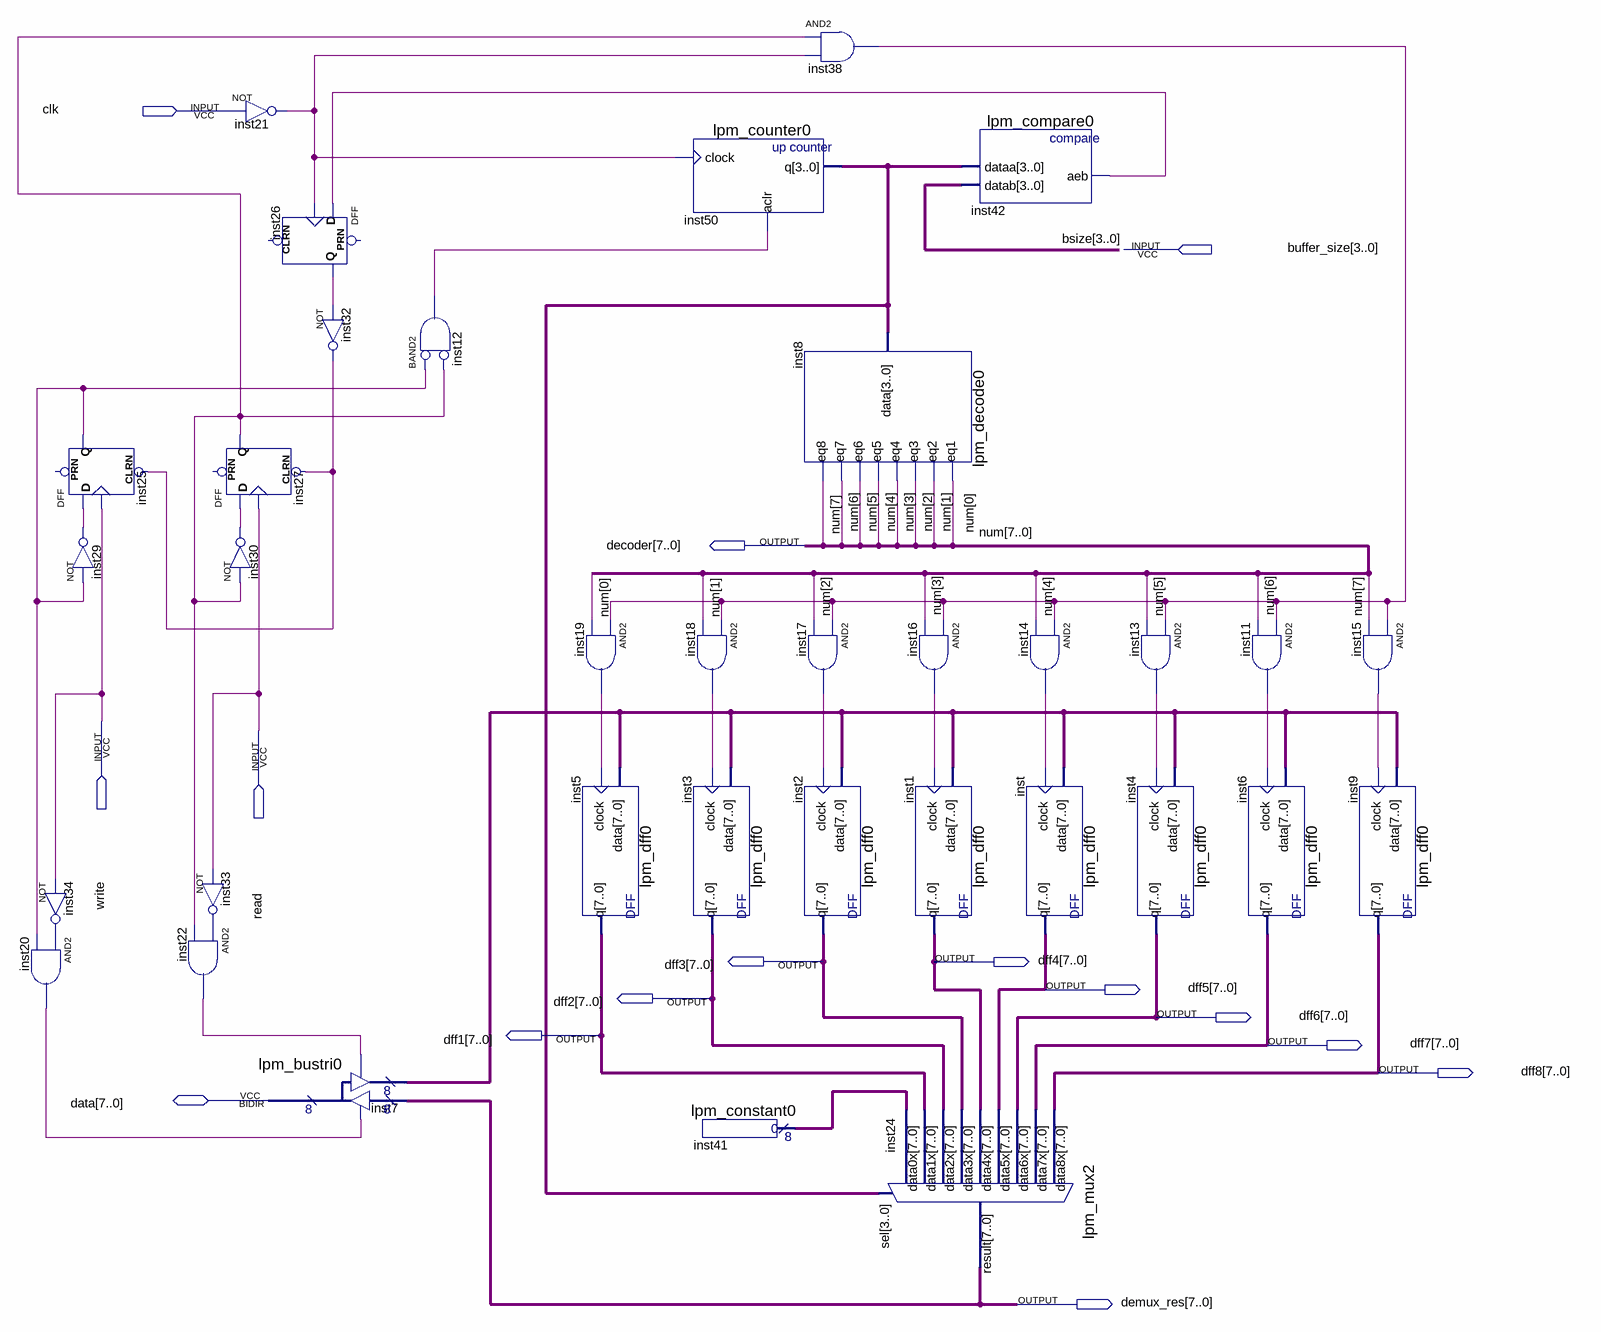
[diagram p0: schematic sheet]
// Quartus schematic Buffer.bdf as structural Verilog: 35 symbols, 15 pins
module Buffer (
  input  clk,
  input  [3:0] buffer_size,
  input  write,
  input  read,
  inout  [7:0] data,
  output [7:0] decoder,
  output [7:0] dff3,
  output [7:0] dff4,
  output [7:0] dff5,
  output [7:0] dff2,
  output [7:0] dff6,
  output [7:0] dff1,
  output [7:0] dff7,
  output [7:0] dff8,
  output [7:0] demux_res
);

  wire inst11_out, inst12_out, inst13_out, inst14_out, inst15_out, inst16_out, inst17_out, inst18_out,
       inst19_out, inst20_out, inst21_out, inst22_out, inst25_q, inst26_q, inst27_q, inst29_out, inst30_out,
       inst32_out, inst33_out, inst34_out, inst38_out, inst42_aeb;
  wire [3:0] inst50_q;
  wire [7:0] inst7_result, inst41_result;

  DFF inst25 (.CLRN(inst32_out), .CLK(write), .D(inst29_out), .Q(inst25_q));  // open: PRN
  not inst29 (inst29_out, inst25_q);
  not inst34 (inst34_out, write);
  and inst20 (inst20_out, inst34_out, inst25_q);
  not inst21 (inst21_out, clk);
  DFF inst27 (.CLRN(inst32_out), .CLK(read), .D(inst30_out), .Q(inst27_q));  // open: PRN
  not inst30 (inst30_out, inst27_q);
  not inst33 (inst33_out, read);
  and inst22 (inst22_out, inst33_out, inst27_q);
  DFF inst26 (.CLK(inst21_out), .D(inst42_aeb), .Q(inst26_q));  // open: CLRN, PRN
  lpm_bustri0 inst7 (
    .enabledt(inst20_out), .data(demux_res), .enabletr(inst22_out), .result(inst7_result), .tridata(data));
  not inst32 (inst32_out, inst26_q);
  and inst12 (inst12_out, ~inst25_q, ~inst27_q);  // BAND2
  and inst19 (inst19_out, inst38_out, decoder[0]);
  lpm_dff0 inst5 (.data(inst7_result), .clock(inst19_out), .q(dff1));
  lpm_counter0 inst50 (.clock(inst21_out), .aclr(inst12_out), .q(inst50_q));
  lpm_dff0 inst3 (.data(inst7_result), .clock(inst18_out), .q(dff2));
  and inst18 (inst18_out, inst38_out, decoder[1]);
  lpm_constant0 inst41 (.result(inst41_result));
  and inst38 (inst38_out, inst27_q, inst21_out);
  lpm_decode0 inst8 (
    .data(inst50_q), .eq1(decoder[0]), .eq2(decoder[1]), .eq3(decoder[2]), .eq4(decoder[3]),
    .eq5(decoder[4]), .eq6(decoder[5]), .eq7(decoder[6]), .eq8(decoder[7]));
  and inst17 (inst17_out, inst38_out, decoder[2]);
  lpm_dff0 inst2 (.data(inst7_result), .clock(inst17_out), .q(dff3));
  lpm_dff0 inst1 (.data(inst7_result), .clock(inst16_out), .q(dff4));
  lpm_mux2 inst24 (
    .data8x(dff8), .data7x(dff7), .data6x(dff6), .data5x(dff5), .data4x(dff4), .data3x(dff3), .data2x(dff2),
    .data1x(dff1), .data0x(inst41_result), .sel(inst50_q), .result(demux_res));
  lpm_compare0 inst42 (.dataa(inst50_q), .datab(buffer_size), .aeb(inst42_aeb));
  and inst16 (inst16_out, inst38_out, decoder[3]);
  and inst14 (inst14_out, inst38_out, decoder[4]);
  lpm_dff0 inst (.data(inst7_result), .clock(inst14_out), .q(dff5));
  lpm_dff0 inst4 (.data(inst7_result), .clock(inst13_out), .q(dff6));
  and inst13 (inst13_out, inst38_out, decoder[5]);
  and inst11 (inst11_out, inst38_out, decoder[6]);
  lpm_dff0 inst6 (.data(inst7_result), .clock(inst11_out), .q(dff7));
  lpm_dff0 inst9 (.data(inst7_result), .clock(inst15_out), .q(dff8));
  and inst15 (inst15_out, inst38_out, decoder[7]);

  // Other names for the same wires on the sheet: bsize[3:0] = buffer_size; num[7:0] = decoder
endmodule
